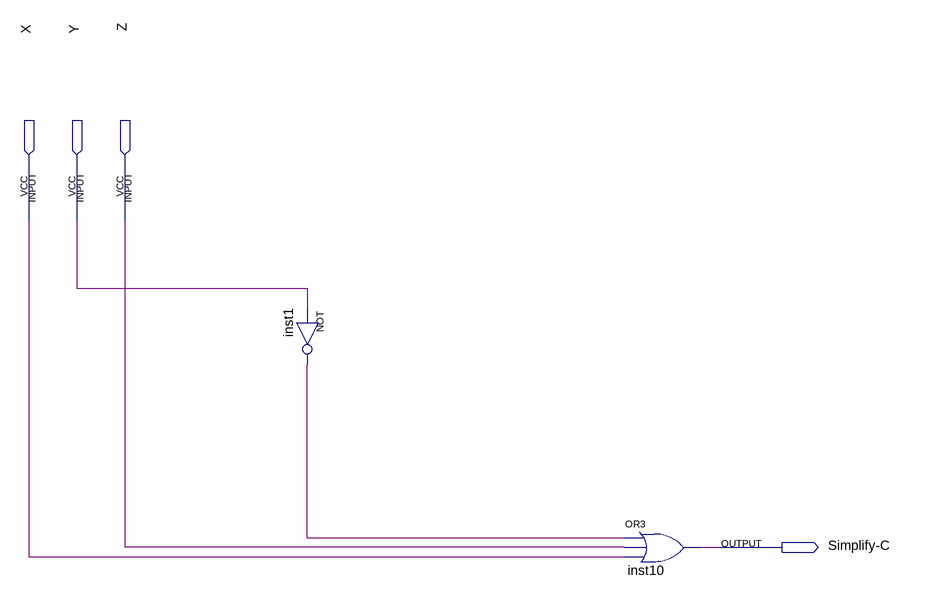
[diagram p0: schematic sheet]
// Quartus schematic Simplify-C.bdf as structural Verilog: 2 symbols, 4 pins
module \Simplify-C  (
  input  X,
  input  Y,
  input  Z,
  output \Simplify-C 
);

  wire inst1_out;

  not inst1 (inst1_out, Y);
  or inst10 (\Simplify-C , inst1_out, Z, X);
endmodule
